# EAGLE design amp_board (EAGLE 5.11)
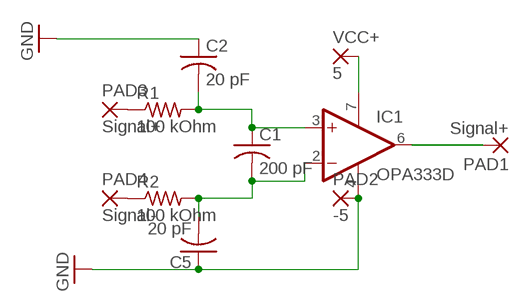
[diagram p0: schematic, sheet 1]

## Parts
C1  200 pF  C-USC0603  [C0603]
C2  20 pF  C-USC0603  [C0603]
C5  20 pF  C-USC0603  [C0603]
IC1  OPA333D  [SO08]
PAD1  Signal+  3,17/1,1  [3,17/1,1]
PAD2  -5  3,17/1,1  [3,17/1,1]
PAD3  Signal+  3,17/1,1  [3,17/1,1]
PAD4  Signal-  3,17/1,1  [3,17/1,1]
R1  100 kOhm  R-US_R0603  [R0603]
R2  100 kOhm  R-US_R0603  [R0603]
VCC+  5  3,17/1,1  [3,17/1,1]

## Nets
GND: C2.1 C5.1 IC1.4(V-) PAD2.1(P)
N$1: C1.1 C2.2 IC1.3(+IN) R1.2
N$2: C1.2 C5.2 IC1.2(-IN) R2.2
N$3: PAD3.1(P) R1.1
N$4: IC1.6(OUT) PAD1.1(P)
N$6: PAD4.1(P) R2.1
NAME: IC1.7(V+) VCC+.1(P)

## Library data of the parts
C1 C2 C5 = resistor:C-US: CAPACITOR, American symbol
IC1 = linear:OPA333: 1.8V, microPOWER CMOS OPERATIONAL AMPLIFIERS Zerø-Drift Series Source: Texas Instruments (Burr-Brown) .. U11 opa333 Operational Amp.pdf
PAD1-PAD4 VCC+ = wirepad:3,17/1,1: THROUGH-HOLE PAD
R1 R2 = resistor:R-US_: RESISTOR, American symbol

## Board
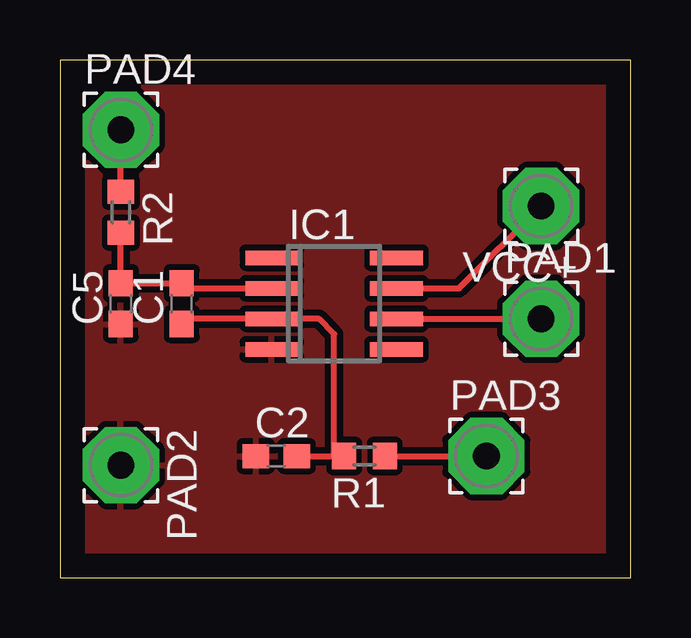
[diagram p1: board, top side]

Size 23.8 x 21.58 mm. Coordinates in mm from the lower left corner, seen from the top.
Outline: 0,0 23.8,0 23.8,21.58 0,21.58 0,0
Copper layers (1*16): Top 0.035mm / dielectric 1.5mm / Bottom 0.035mm
Design rules "default": minimum track width 10mil, minimum drill 24mil, track to track 8mil, track to pad 8mil, pad to pad 8mil, via to via 8mil, smd to smd 8mil, copper to edge 40mil, drill to drill 8mil, minimum pad ring 10mil, minimum via ring 8mil, stop-mask expansion 4mil, vias tented up to drill 0mil, thermal gap 10mil
Milling: 4 lines

### Footprints (pad centres in the part's own frame; a part is rotated, then mirrored left to right if it is on the bottom)
C0603 = smd 1.1 x 1: 1 -0.85,0; 2 0.85,0
SO08 = smd 0.6 x 2.2: 1 -1.905,-2.6; 2 -0.635,-2.6; 3 0.635,-2.6; 4 1.905,-2.6; 5 1.905,2.6; 6 0.635,2.6; 7 -0.635,2.6; 8 -1.905,2.6
3,17/1,1 = drill 1.118 pad 3.175 octagon: 1 0,0
R0603 = smd 1 x 1.1: 1 -0.85,0; 2 0.85,0

### Placement (x,y rotation side)
C1  5.08,11.43 90 top
C2  9.02,5.08 0 top
C5  2.54,11.43 90 top
IC1  11.43,11.43 270 top
PAD1  20.07,10.8 0 top
PAD2  2.54,4.7 270 top
PAD3  17.78,5.08 0 top
PAD4  2.54,18.67 0 top
R1  12.7,5.08 180 top
R2  2.54,15.24 270 top
VCC+  20.07,15.49 180 top

### Tracks (layer width: path | path; a pad name or v marks a point on that pad's centre or on a via)
GND
  pour Top (isolate 0.254): 24.13,21.59 0,21.59 0,0 24.13,0
N$1
  Top 0.254: C1.1 5.3,10.8 IC1.3 10.8,10.8 11.43,10.16 11.43,5.08 R1.2 C2.2
N$2
  Top 0.254: R2.2 C5.2 C1.2 5.3,12.06 IC1.2
N$3
  Top 0.254: R1.1 PAD3.1
N$4
  Top 0.254: IC1.6 PAD1.1
N$6
  Top 0.254: R2.1 PAD4.1
NAME
  Top 0.254: IC1.7 16.64,12.06 VCC+.1